# EasyEDA Pro project ProProject_51_card_2024-05-25.epro

# Schematic ProjectM.2-核心板
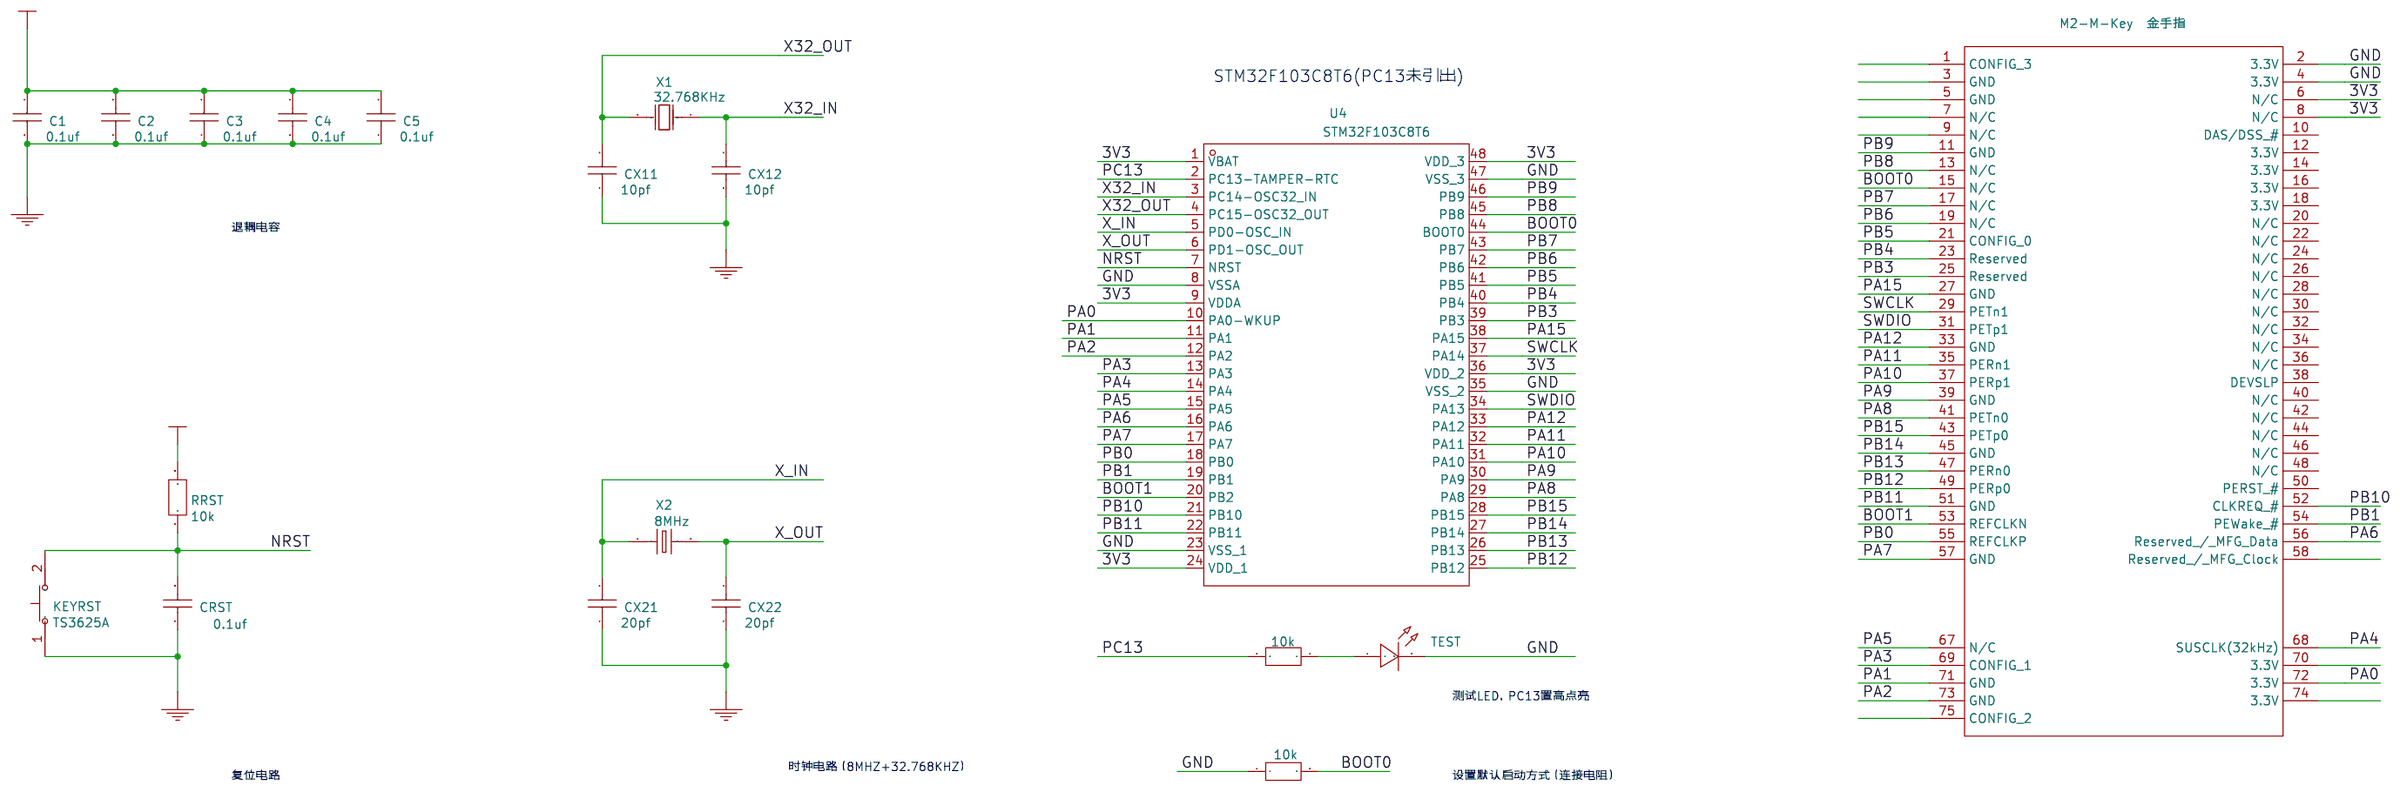
[diagram p0: schematic sheet]

## Parts
C1  0.1uf
C2  0.1uf
C3  0.1uf
C4  0.1uf
C5  0.1uf
CRST  0.1uf
CX11  10pf
CX12  10pf
CX21  20pf
CX22  20pf
KEYRST  TS3625A
RBM1  10k
RLED  10k
RRST  10k
TEST  TEST
U1  M2-M-Key  金手指
U4  STM32F103C8T6
X1  32.768KHz
X2  8MHz

## Library data of the parts
C1-C5 CRST CX11 CX12 CX21 CX22 = ?: Capacitor
KEYRST = TS3625A: Supplier: LCSC; Supplier Part: C398053; Manufacturer: SHOU HAN
RBM1 RLED RRST = 10k
TEST = 19-217/R6C-AL1M2VY/3T: Manufacturer: EVERLIGHT(台湾亿光); Supplier Part: C72044; Supplier: LCSC
U1 = M2-M-Key  金手指
U4 = STM32F103C8T6: Supplier: LCSC; Manufacturer: STMicroelectronics; image: //image.lceda.cn/szlcsc/C8734.jpg; Supplier Part: C8734; JLCPCB Part Class: Basic
X1 = VT-200-F-32.768kHz-20PPM-12.5pF: Supplier: LCSC; Supplier Part: C398714; Manufacturer: Seiko
X2 = XIHCELNANF-8MHZ: Supplier: LCSC; Supplier Part: C295088; Manufacturer: TAITIEN Elec

## Nets
3V3: C1.2 C2.2 C3.2 C4.2 C5.2 RRST.2 U1.6(N/C) U1.8(N/C) U4.1(VBAT) U4.9(VDDA) U4.24(VDD_1) U4.36(VDD_2) U4.48(VDD_3)
GND: C1.1 C2.1 C3.1 C4.1 C5.1 CRST.1 CX11.1 CX12.1 CX21.1 CX22.1 KEYRST.1 RBM1.1 TEST.2 U1.2(3.3V) U1.4(3.3V) U4.8(VSSA) U4.23(VSS_1) U4.35(VSS_2) U4.47(VSS_3)
BOOT0: RBM1.2 U1.15(N/C) U4.44(BOOT0)
BOOT1: U1.53(REFCLKN) U4.20(PB2)
NRST: CRST.2 KEYRST.2 RRST.1 U4.7(NRST)
PA0: U1.72(3.3V) U4.10(PA0-WKUP)
PA1: U1.71(GND) U4.11(PA1)
PA2: U1.73(GND) U4.12(PA2)
PA3: U1.69(CONFIG_1) U4.13(PA3)
PA4: U1.68(SUSCLK(32kHz)) U4.14(PA4)
PA5: U1.67(N/C) U4.15(PA5)
PA6: U1.56(Reserved / MFG Data) U4.16(PA6)
PA7: U1.57(GND) U4.17(PA7)
PA8: U1.41(PETn0) U4.29(PA8)
PA9: U1.39(GND) U4.30(PA9)
PA10: U1.37(PERp1) U4.31(PA10)
PA11: U1.35(PERn1) U4.32(PA11)
PA12: U1.33(GND) U4.33(PA12)
PA15: U1.27(GND) U4.38(PA15)
PB0: U1.55(REFCLKP) U4.18(PB0)
PB1: U1.54(PEWake #) U4.19(PB1)
PB3: U1.25(Reserved) U4.39(PB3)
PB4: U1.23(Reserved) U4.40(PB4)
PB5: U1.21(CONFIG_0) U4.41(PB5)
PB6: U1.19(N/C) U4.42(PB6)
PB7: U1.17(N/C) U4.43(PB7)
PB8: U1.13(N/C) U4.45(PB8)
PB9: U1.11(GND) U4.46(PB9)
PB10: U1.52(CLKREQ #) U4.21(PB10)
PB11: U1.51(GND) U4.22(PB11)
PB12: U1.49(PERp0) U4.25(PB12)
PB13: U1.47(PERn0) U4.26(PB13)
PB14: U1.45(GND) U4.27(PB14)
PB15: U1.43(PETp0) U4.28(PB15)
PC13: RLED.2 U4.2(PC13-TAMPER-RTC)
SWCLK: U1.29(PETn1) U4.37(PA14)
SWDIO: U1.31(PETp1) U4.34(PA13)
X32_IN: CX12.2 U4.3(PC14-OSC32_IN) X1.1(OSC1)
X32_OUT: CX11.2 U4.4(PC15-OSC32_OUT) X1.2(OSC2)
X_IN: CX21.2 U4.5(PD0-OSC_IN) X2.1
X_OUT: CX22.2 U4.6(PD1-OSC_OUT) X2.2
Net-(RLED-1): RLED.1 TEST.1

Not connected (* = marked no-connect by the designer): U1 1(CONFIG_3) 3(GND) 5(GND) 7(N/C) 9(N/C) 10(DAS/DSS #) 12(3.3V) 14(3.3V) 16(3.3V) 18(3.3V) 20(N/C) 22(N/C) 24(N/C) 26(N/C) 28(N/C) 30(N/C) 32(N/C) 34(N/C) 36(N/C) 38(DEVSLP) 40(N/C) 42(N/C) 44(N/C) 46(N/C) 48(N/C) 50(PERST #) 58(Reserved / MFG Clock) 70(3.3V) 74(3.3V) 75(CONFIG_2)

## Notes on the sheet
- STM32F103C8T6(PC13未引出)
- 退耦电容
- 测试LED，PC13置高点亮
- 时钟电路（8MHZ+32.768KHZ）
- 复位电路
- 设置默认启动方式（连接电阻）

# Schematic Schematic1
Create Date: 2024-05-22; Page Name: P1; Project Name: 51_card; Schematic Name: Schematic1; Update Date: 2024-05-22; Company: 嘉立创EDA; Page Size: A4; Version: V1.0
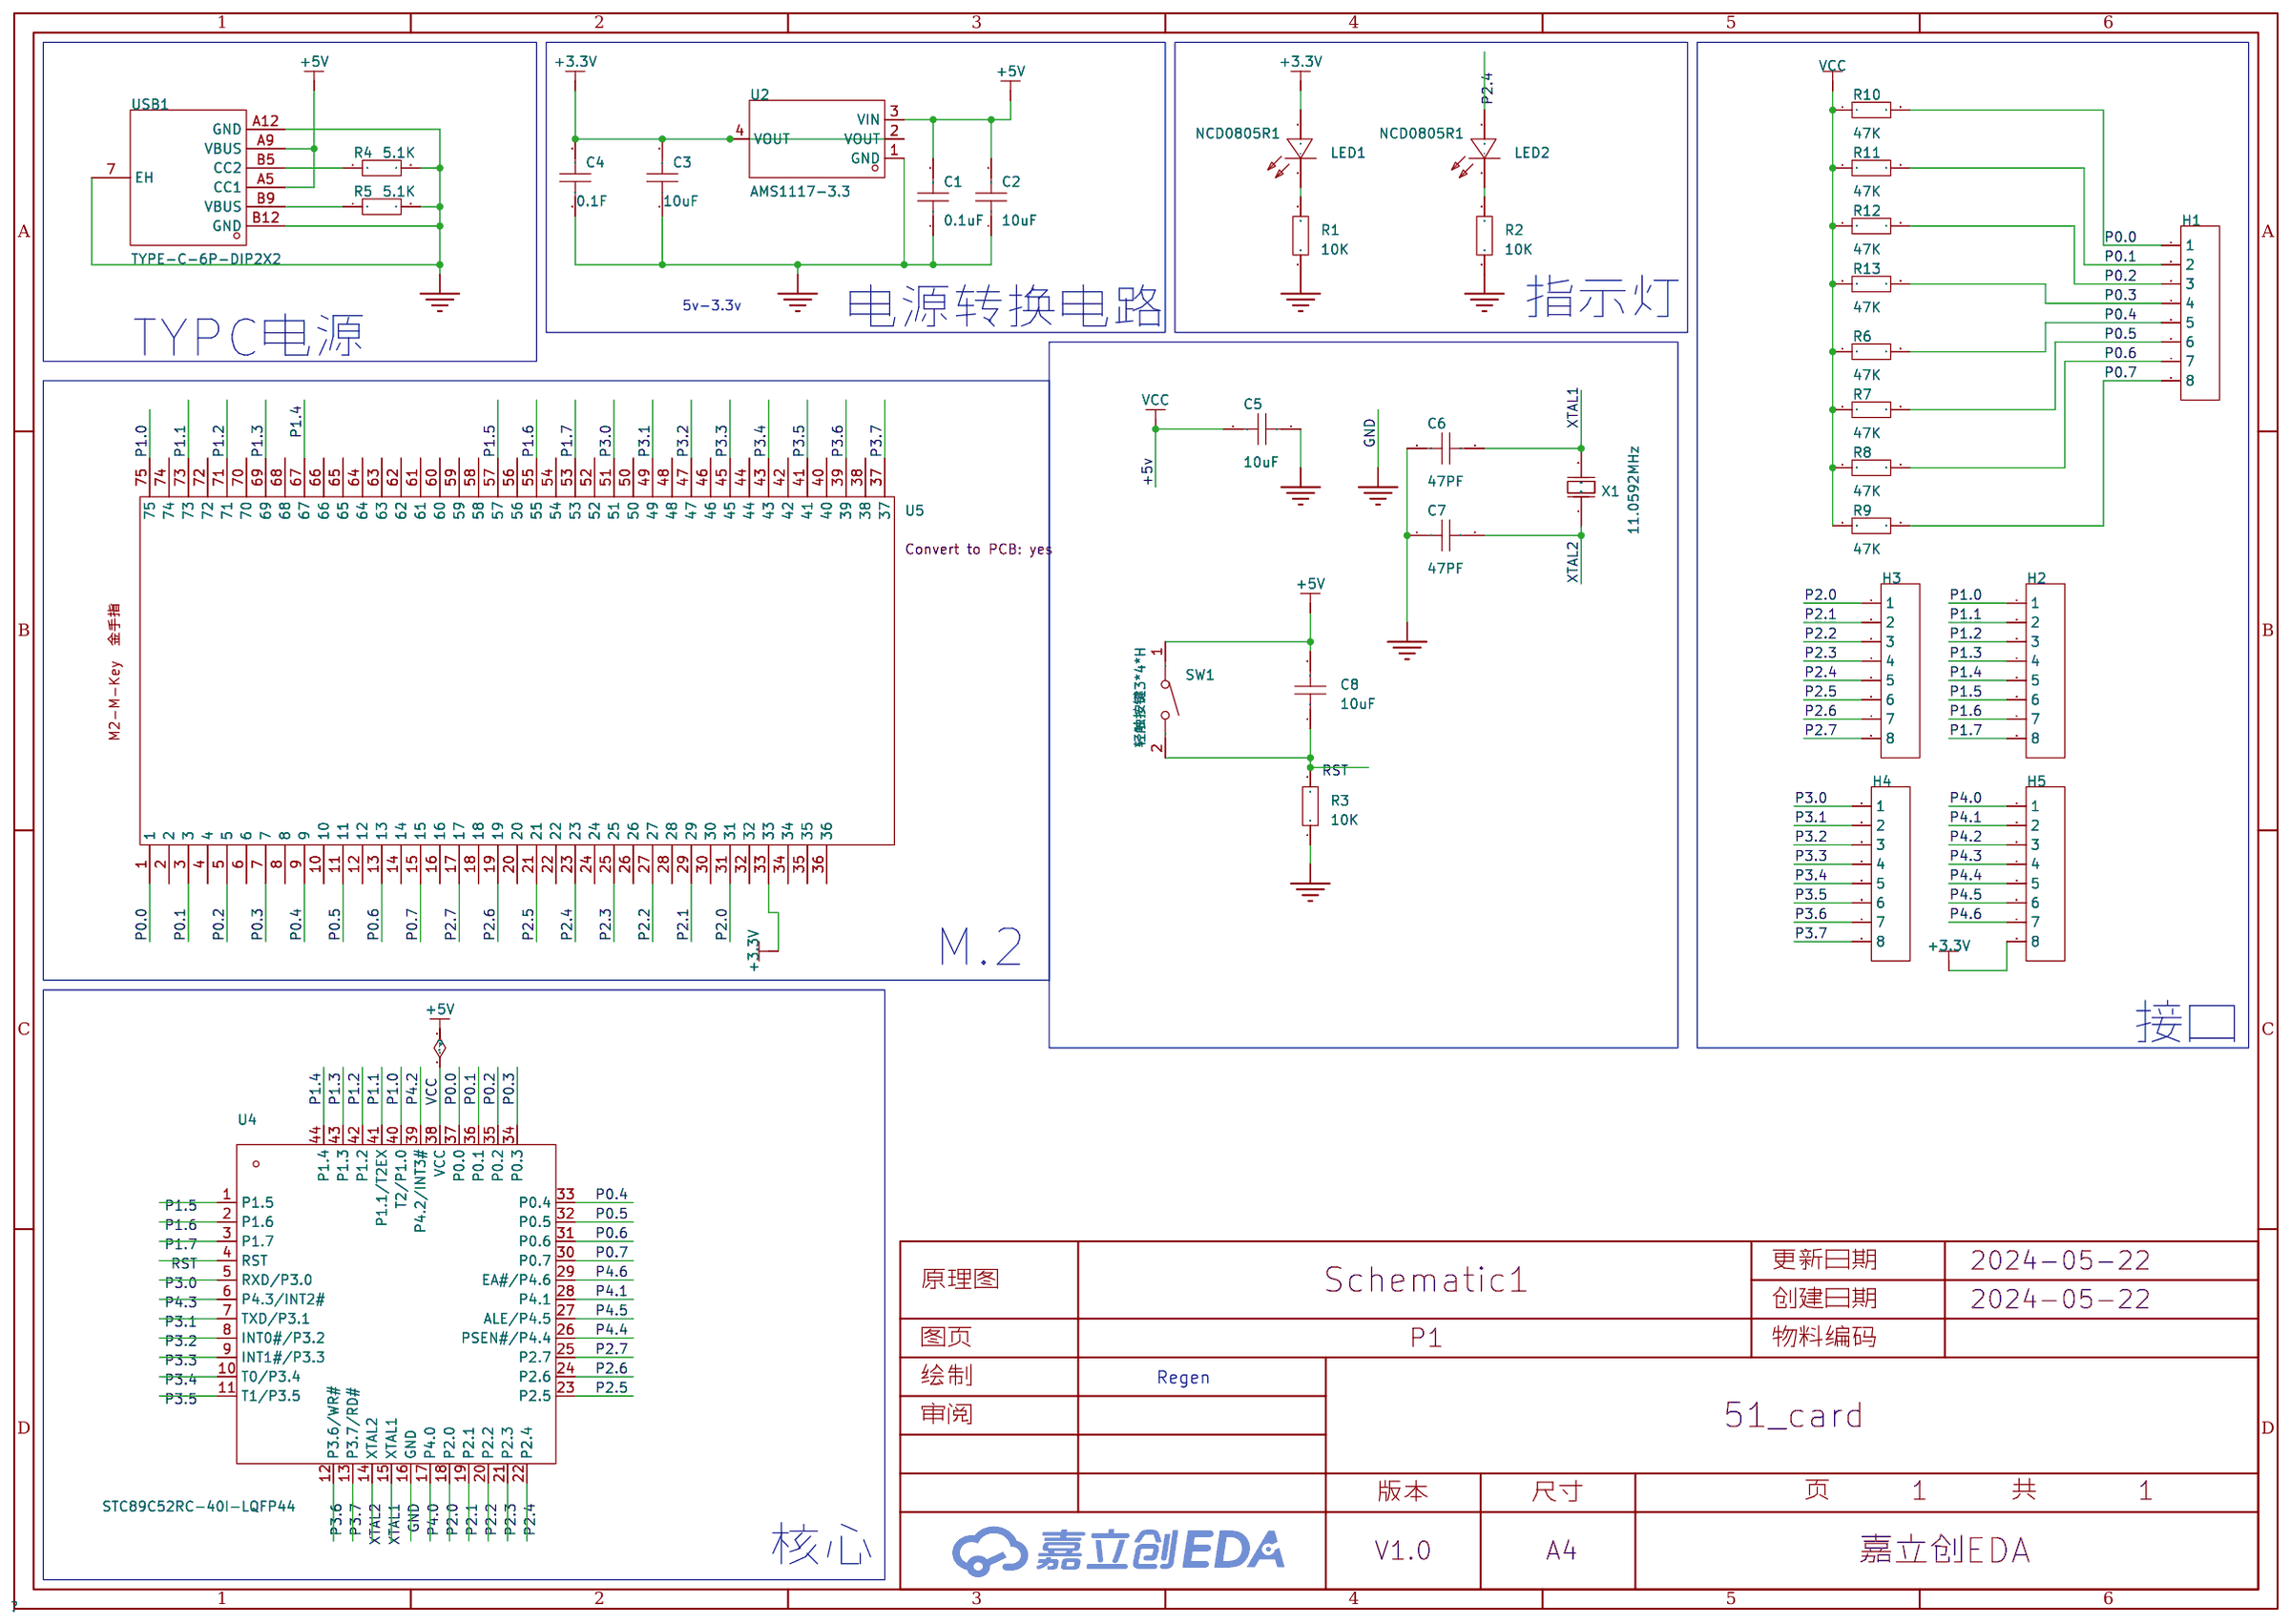
[diagram p1: schematic sheet]

## Parts
C1  0.1uF  [C0603]
C2  10uF  [C0603]
C3  10uF  [C0603]
C4  0.1F  [C0603]
C5  10uF  [C0603]
C6  47PF  [C0603]
C7  47PF  [C0603]
C8  10uF  [C0805]
H1  -  [HDR-TH_8P-P2.54-V-F-1]
H2  -  [HDR-TH_8P-P2.54-V-F-1]
H3  -  [HDR-TH_8P-P2.54-V-F-1]
H4  -  [HDR-TH_8P-P2.54-V-F-1]
H5  -  [HDR-TH_8P-P2.54-V-F-1]
LED1  NCD0805R1  [LED0805-R-RD]
LED2  NCD0805R1  [LED0805-R-RD]
R1  10K  [R0603]
R2  10K  [R0603]
R3  10K  [R0805]
R4  5.1K  [R0805]
R5  5.1K  [R0805]
R6  47K  [R0805]
R7  47K  [R0805]
R8  47K  [R0805]
R9  47K  [R0805]
R10  47K  [R0805]
R11  47K  [R0805]
R12  47K  [R0805]
R13  47K  [R0805]
SW1  轻触按键3*4*H  [SW-SMD_L4.0-W2.9-LS5.0]
U2  AMS1117-3.3  [SOT-223-3_L6.5-W3.4-P2.30-LS7.0-BR]
U4  STC89C52RC-40I-LQFP44  [LQFP-44_L10.0-W10.0-P0.80-LS12.0-BL]
U5  -  [m.2]
USB1  TYPE-C-6P-DIP2X2  [TYPE-C-SMD_TYPE-C-6P]
X1  11.0592MHz  [HC-49S_L11.4-W4.8]

## Library data of the parts
C1-C7 = CAP_0603: Supplier Footprint: 0603
C8 = CAP_0805: Supplier Footprint: 0805
H1-H5 = HDR-F_2.54_1x8P: Supplier Part: C27438; Supplier Footprint: 插件
LED1 LED2 = NCD0805R1: 灯头类型:-;发光颜色:红色;正向电压(VF):1.6V~2.6V;功率:65mW;正向电流:20mA;主波长:615nm~630nm;二极管配置:独立二极管;透镜颜色:无色透明透镜;色温:-;发光强度:67mcd~195mcd;发光角度:130°;载带方式:-;工作温度:-30℃~+85℃;; Supplier Part: C84256; Manufacturer: 国星光电; Supplier Footprint: 0805; JLCPCB Part Class: 基础库; Datasheet: https://atta.szlcsc.com/upload/public/pdf/source/20200820/C84256_F0A75A43B3EAD75808600A0514C76B99.pdf; Supplier: LCSC; Emitted Color: 红色; Forward Voltage (VF): 1.6V~2.6V; Power Dissipation: 65mW; Forward Current: 20mA; Dominant Wavelength: 615nm~630nm; Diode Configuration: 独立二极管; Lens Color: 无色透明透镜; Luminous Intensity: 67mcd~195mcd; Viewing Angle: 130°; Operating Temperature: -30℃~+85℃
R1 R2 = Res_0603: Supplier Footprint: 0603
R3-R13 = Res_0805: Supplier Footprint: 0805
SW1 = 轻触按键3*4*H: Supplier Part: C9900017573; Supplier Footprint: 轻触按键3*4*2.5; JLCPCB Part Class: 扩展库; Supplier: LCSC
U2 = AMS1117-3.3_C6186: 输出类型:固定;最大输入电压:-;输出电压:3.3V;最大输出电流:1A;电源纹波抑制比(PSRR):72dB@(120Hz);输出极性:正极;; LCSC Part Name: 输出3.3V 1A; Supplier Part: C6186; Manufacturer: AMS; Supplier Footprint: SOT-223-3; JLCPCB Part Class: 基础库; Datasheet: https://atta.szlcsc.com/upload/public/pdf/source/20180727/C6186_7A095716F0823C02F1997A905E26C086.pdf; Supplier: LCSC; Output Type: 固定; Output Voltage: 3.3V; MAX Output Current: 1A; Power Supply Rejection Ratio (PSRR): 72dB@(120Hz); Dropout Voltage: 1.3V@(800mA); Output Polarity: 正极; Number of Outputs: 1
U4 = STC89C52RC-40I-LQFP44: CPU内核:51系列;程序存储容量:8KB;RAM总容量:512Byte;GPIO端口数量:39;工作电压范围:3.3V~5.5V;CPU最大主频:-;程序存储器类型:FLASH;; Supplier Part: C8707; Manufacturer: STC(宏晶); Supplier Footprint: LQFP-44(10x10); JLCPCB Part Class: 扩展库; Datasheet: https://atta.szlcsc.com/upload/public/pdf/source/20131218/1457706663573.pdf; Supplier: LCSC; CPU Core: 51系列; Program Storage Size: 8KB; RAM Size: 512Byte; GPIO Ports Number: 39; Operating Voltage Range: 3.3V~5.5V; Program Memory Type: FLASH; Operating Temperature Range: -40℃~+85℃; 16Bit Timer: 3; UART/USART: 1; Peripheral/Function: 看门狗; Watchdog: 有
U5 = m.2 gloden finger
USB1 = TYPE-C-6P-DIP2X2: Supplier Part: C9900017627; Supplier Footprint: TYPE-C-6P; JLCPCB Part Class: 扩展库; Supplier: LCSC
X1 = 49MD-11.0592-20-20-20/A: 晶振类型:贴片晶振;频率:11.0592MHz;常温频差:±20ppm;外接负载电容:20pF;频率稳定度(全温):±20ppm;; LCSC Part Name: 11.0592MHz ±20ppm 20pF; Supplier Part: C240958; Manufacturer: LIMING(利明); Supplier Footprint: HC-49S-SMD; JLCPCB Part Class: 扩展库; Datasheet: https://atta.szlcsc.com/upload/public/pdf/source/20180904/C240991_E2F04D311D9C4C22D828B1AE19EA4706.pdf; Supplier: LCSC; Crystal Type: 贴片晶振; Normal temperature Frequency Tolerance: ±20ppm; External load capacitor: 20pF; Frequency Stability(Full temperature range): ±20ppm; Operating Temperature: -20℃~+70℃

## Nets
+3.3V: C3.2 C4.2 H5.8 LED1.1(+) U2.2(VOUT) U2.4(VOUT) U5.33
+5V: C1.2 C2.2 C5.2 C8.2 R6.1 R7.1 R8.1 R9.1 R10.1 R11.1 R12.1 R13.1 SW1.1 U2.3(VIN) U4.38(VCC) USB1.A5(CC1) USB1.A9(VBUS)
GND: C1.1 C2.1 C3.1 C4.1 C5.1 C6.1 C7.1 R1.1 R2.1 R3.1 R4.2 R5.2 U2.1(GND) U4.16(GND) USB1.7(EH) USB1.A12(GND) USB1.B12(GND)
P0.0: H1.1 R10.2 U4.37(P0.0) U5.1
P0.1: H1.2 R11.2 U4.36(P0.1) U5.3
P0.2: H1.3 R12.2 U4.35(P0.2) U5.5
P0.3: H1.4 R13.2 U4.34(P0.3) U5.7
P0.4: H1.5 R6.2 U4.33(P0.4) U5.9
P0.5: H1.6 R7.2 U4.32(P0.5) U5.11
P0.6: H1.7 R8.2 U4.31(P0.6) U5.13
P0.7: H1.8 R9.2 U4.30(P0.7) U5.15
P1.0: H2.1 U4.40(T2/P1.0) U5.75
P1.1: H2.2 U4.41(P1.1/T2EX) U5.73
P1.2: H2.3 U4.42(P1.2) U5.71
P1.3: H2.4 U4.43(P1.3) U5.69
P1.4: H2.5 U4.44(P1.4) U5.67
P1.5: H2.6 U4.1(P1.5) U5.57
P1.6: H2.7 U4.2(P1.6) U5.55
P1.7: H2.8 U4.3(P1.7) U5.53
P2.0: H3.1 U4.18(P2.0) U5.31
P2.1: H3.2 U4.19(P2.1) U5.29
P2.2: H3.3 U4.20(P2.2) U5.27
P2.3: H3.4 U4.21(P2.3) U5.25
P2.4: H3.5 LED2.1(+) U4.22(P2.4) U5.23
P2.5: H3.6 U4.23(P2.5) U5.21
P2.6: H3.7 U4.24(P2.6) U5.19
P2.7: H3.8 U4.25(P2.7) U5.17
P3.0: H4.1 U4.5(RXD/P3.0) U5.51
P3.1: H4.2 U4.7(TXD/P3.1) U5.49
P3.2: H4.3 U4.8(INT0#/P3.2) U5.47
P3.3: H4.4 U4.9(INT1#/P3.3) U5.45
P3.4: H4.5 U4.10(T0/P3.4) U5.43
P3.5: H4.6 U4.11(T1/P3.5) U5.41
P3.6: H4.7 U4.12(P3.6/WR#) U5.39
P3.7: H4.8 U4.13(P3.7/RD#) U5.37
P4.0: H5.1 U4.17(P4.0)
P4.1: H5.2 U4.28(P4.1)
P4.2: H5.3 U4.39(P4.2/INT3#)
P4.3: H5.4 U4.6(P4.3/INT2#)
P4.4: H5.5 U4.26(PSEN#/P4.4)
P4.5: H5.6 U4.27(ALE/P4.5)
P4.6: H5.7 U4.29(EA#/P4.6)
RST: C8.1 R3.2 SW1.2 U4.4(RST)
XTAL1: C6.2 U4.15(XTAL1) X1.2(OSC2)
XTAL2: C7.2 U4.14(XTAL2) X1.1(OSC1)
$1N502: LED1.2(-) R1.2
$1N504: LED2.2(-) R2.2
$1N2677: R4.1 USB1.B5(CC2)
$1N2681: R5.1 USB1.B9(VBUS)

Not connected (* = marked no-connect by the designer): U5 2 4 6 8 10 12 14 16 18 20 22 24 26 28 30 32 34 35 36 38 40 42 44 46 48 50 52 54 56 58 59 60 61 62 63 64 65 66 68 70 72 74

## Notes on the sheet
- 5v-3.3v
- 电源转换电路
- 指示灯
- TYPC电源
- M.2
- 接口
- Regen
- 核心

# Board PCB1
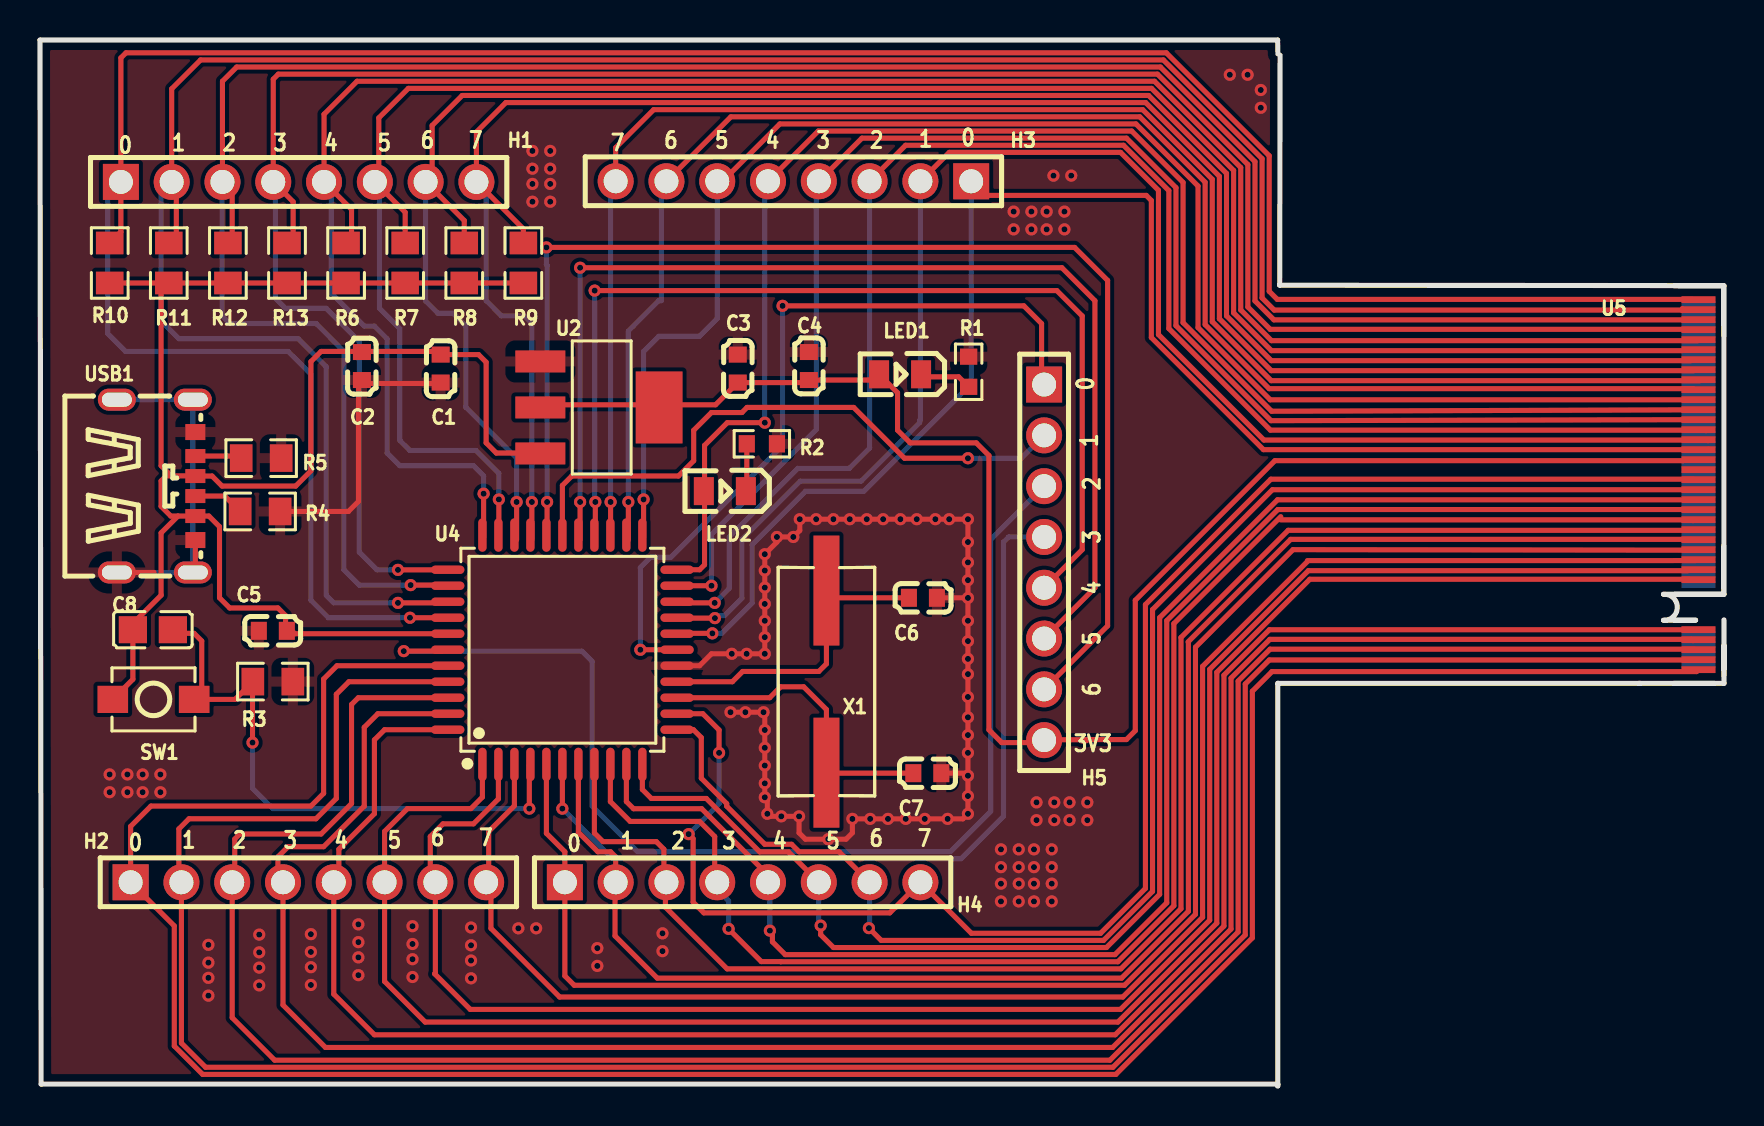
[diagram p2: board, top side]
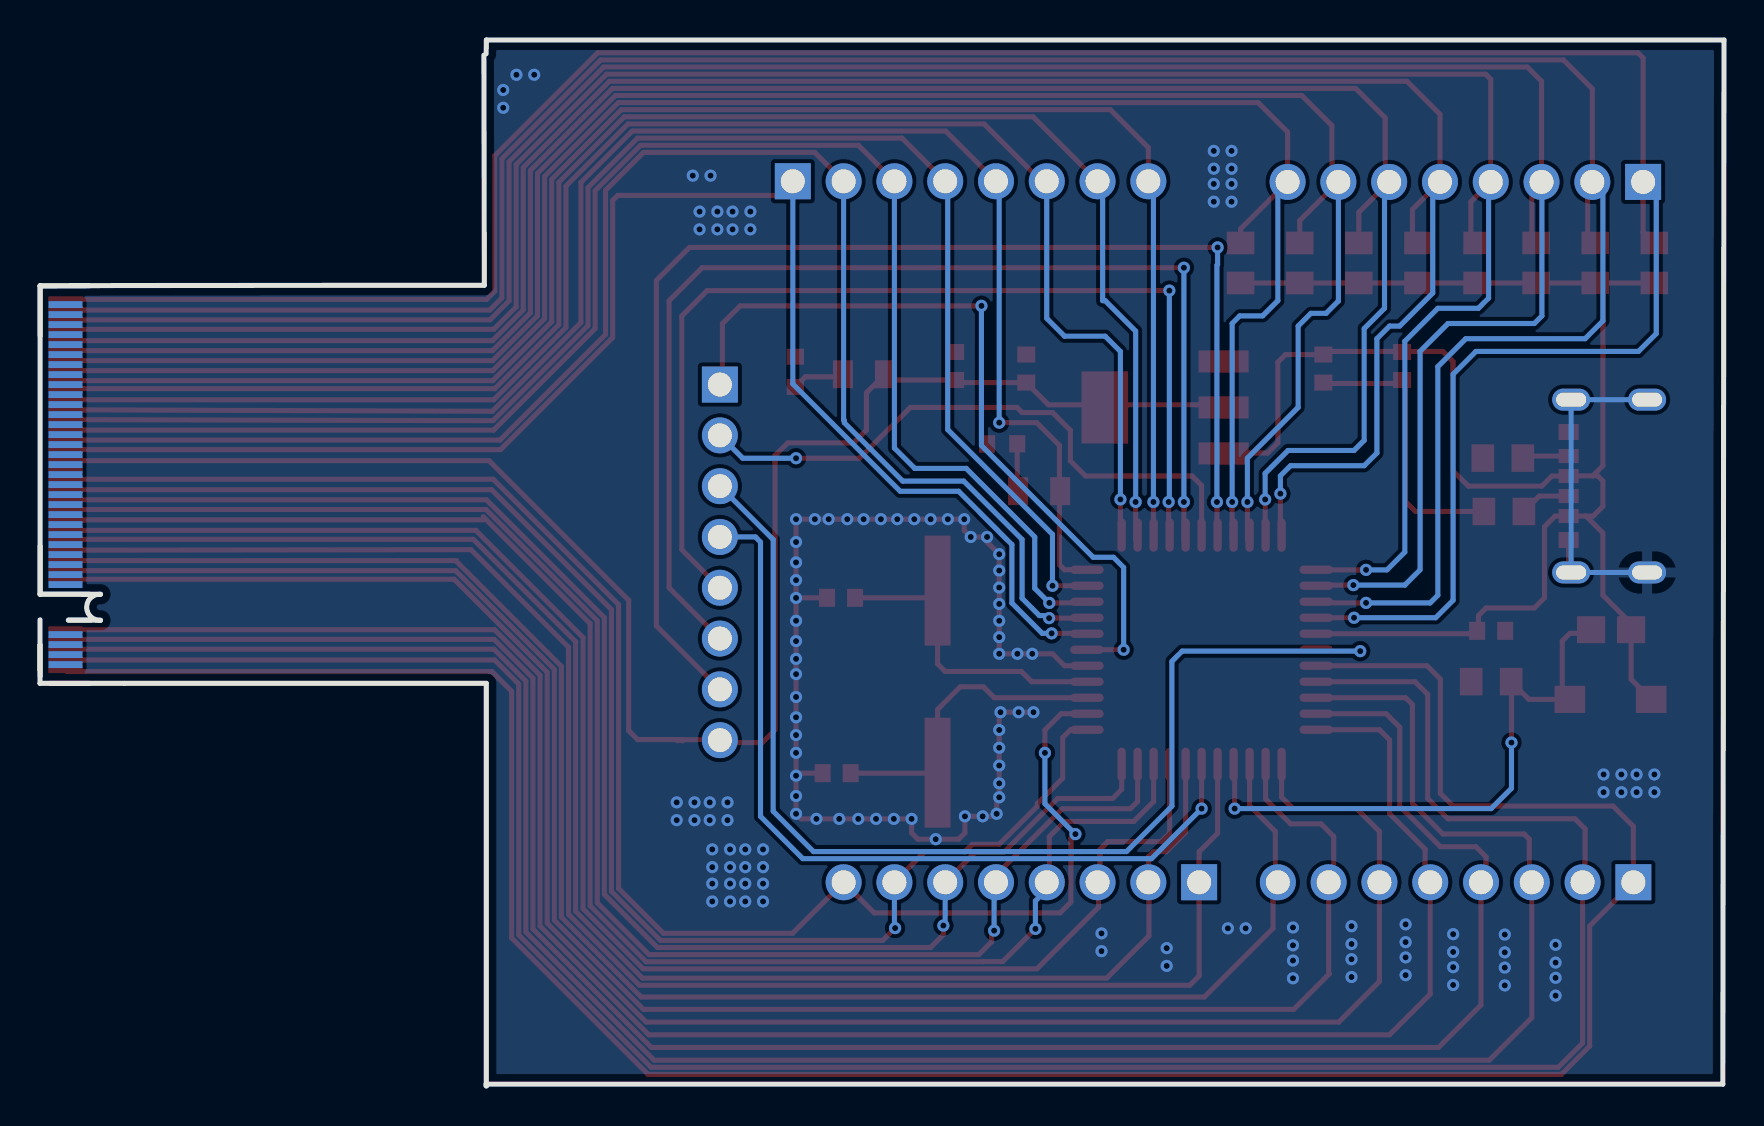
[diagram p3: board, bottom side, seen from below]

Outline 84.22 x 52.3 mm; copper layers: Top Layer, Bottom Layer. Coordinates in mm from the lower left corner of the outline.
Outline path: 61.89,0 61.9,0.01 61.9,20.13 80,20.13 ; 61.91,51.61 61.9,52.3 0,52.3 0.06,0.09 61.91,0.09 61.91,0.02 ; 79.99,40.03 62,40.04 62.02,51.54
Stack: Top Layer 0.035mm / Dielectric1 1.51mm FR4 er 4.5 / Bottom Layer 0.035mm

## Design rules (mm)
net XTAL2: DP1
net XTAL1: DP1
template: JLCPCB Capability(Two Layers Board)
spacing copperThickness1oz (default): track to track 0.102, other pairs 0.152 to 0.3
spacing copperThickness2oz: track to track 0.203, other pairs 0.152 to 0.3
track width copperThickness1oz (default): min 0.127, default 0.254, max 2.54
track width copperThickness2oz: min 0.203, default 0.254, max 2.54
differential pair differentialPair (default): width min 0.127, default 0.254, max 2.54; gap min 0.152, default 0.152
via viaSize (default): diameter min 0.5, default 0.61, max 10; hole min 0.3, default 0.305, max 6.3

## Placement (name value [footprint] x y rotation side)
C1  0.1uF  [C0603]  20.04 35.87 90 top
C2  10uF  [C0603]  16.1 36 90 top
C3  10uF  [C0603]  34.9 35.87 270 top
C4  0.1F  [C0603]  38.45 36 270 top
C5  10uF  [C0603]  11.64 22.76 0 top
C6  47PF  [C0603]  44.16 24.41 180 top
C7  47PF  [C0603]  44.38 15.64 180 top
C8  10uF  [C0805]  5.65 22.82 180 top
H1  -  [HDR-TH_8P-P2.54-V-F-1]  12.94 45.21 0 top
H2  -  [HDR-TH_8P-P2.54-V-F-1]  13.42 10.19 0 top
H3  -  [HDR-TH_8P-P2.54-V-F-1]  37.68 45.24 180 top
H4  -  [HDR-TH_8P-P2.54-V-F-1]  35.14 10.19 0 top
H5  -  [HDR-TH_8P-P2.54-V-F-1]  50.22 26.18 270 top
LED1  NCD0805R1  [LED0805-R-RD]  43.01 35.59 180 top
LED2  NCD0805R1  [LED0805-R-RD]  34.25 29.75 180 top
R1  10K  [R0603]  46.44 35.71 270 top
R2  10K  [R0603]  36.1 32.11 180 top
R3  10K  [R0805]  11.64 20.22 180 top
R4  5.1K  [R0805]  11.01 28.73 0 top
R5  5.1K  [R0805]  11.06 31.4 0 top
R6  47K  [R0805]  15.31 41.15 90 top
R7  47K  [R0805]  18.26 41.15 90 top
R8  47K  [R0805]  21.22 41.15 90 top
R9  47K  [R0805]  24.17 41.15 90 top
R10  47K  [R0805]  3.49 41.15 90 top
R11  47K  [R0805]  6.44 41.15 90 top
R12  47K  [R0805]  9.4 41.15 90 top
R13  47K  [R0805]  12.35 41.15 90 top
SW1  轻触按键3*4*H  [SW-SMD_L4.0-W2.9-LS5.0]  5.68 19.33 0 top
U2  AMS1117-3.3  [SOT-223-3_L6.5-W3.4-P2.30-LS7.0-BR]  27.99 33.93 180 top
U4  STC89C52RC-40I-LQFP44  [LQFP-44_L10.0-W10.0-P0.80-LS12.0-BL]  26.13 21.81 0 top
U5  -  [m.2]  82.1 29.74 0 top
USB1  TYPE-C-6P-DIP2X2  [TYPE-C-SMD_TYPE-C-6P]  5.81 30 270 top
X1  11.0592MHz  [HC-49S_L11.4-W4.8]  39.33 20.22 90 top

## Footprints (pads in the part's own frame, mm; a bottom-side part is the same pattern mirrored in y, then rotated)
C0603
  rect 0.8x0.9 smd: 1(-0.7,0) 2(0.7,0)
C0805
  rect 1.41x1.35 smd: 1(-1,0) 2(1,0)
HC-49S_L11.4-W4.8
  rect 5.5x1.3 smd: 1(-4.553,0) 2(4.553,0)
HDR-TH_8P-P2.54-V-F-1
  rect 1.8x1.8 hole 1.2: 1(-8.89,0)
  round 1.8 hole 1.2: 2(-6.35,0) 3(-3.81,0) 4(-1.27,0) 5(1.27,0) 6(3.81,0) 7(6.35,0) 8(8.89,0)
LED0805-R-RD
  rect 1x1.399 smd: 1(1.05,0) 2(-1.05,0)
LQFP-44_L10.0-W10.0-P0.80-LS12.0-BL
  oval 0.42x1.67 smd: 1(-4,-5.735) 2(-3.2,-5.735) 3(-2.4,-5.735) 4(-1.6,-5.735) 5(-0.8,-5.735) 6(0,-5.735) 7(0.8,-5.735) 8(1.6,-5.735) 9(2.4,-5.735) 10(3.2,-5.735) 11(4,-5.735) 23(4,5.735) 24(3.2,5.735) 25(2.4,5.735) 26(1.6,5.735) 27(0.8,5.735) 28(0,5.735) 29(-0.8,5.735) 30(-1.6,5.735) 31(-2.4,5.735) 32(-3.2,5.735) 33(-4,5.735)
  oval 1.67x0.42 smd: 12(5.735,-4) 13(5.735,-3.2) 14(5.735,-2.4) 15(5.735,-1.6) 16(5.735,-0.8) 17(5.735,0) 18(5.735,0.8) 19(5.735,1.6) 20(5.735,2.4) 21(5.735,3.2) 22(5.735,4) 34(-5.735,4) 35(-5.735,3.2) 36(-5.735,2.4) 37(-5.735,1.6) 38(-5.735,0.8) 39(-5.735,0) 40(-5.735,-0.8) 41(-5.735,-1.6) 42(-5.735,-2.4) 43(-5.735,-3.2) 44(-5.735,-4)
m.2
  rect 1.7x0.34 smd: 1(0.849,9.58) 3(0.849,9.079) 5(0.849,8.579) 7(0.849,8.079) 9(0.849,7.58) 11(0.849,7.08) 13(0.849,6.58) 15(0.849,6.08) 17(0.849,5.58) 19(0.849,5.08) 21(0.849,4.58) 23(0.849,4.08) 25(0.849,3.579) 27(0.849,3.079) 29(0.849,2.579) 31(0.849,2.079) 33(0.849,1.579) 35(0.849,1.079) 37(0.849,0.58) 39(0.849,0.08) 41(0.849,-0.42) 43(0.849,-0.92) 45(0.849,-1.421) 47(0.849,-1.921) 49(0.849,-2.421) 51(0.849,-2.921) 53(0.849,-3.421) 55(0.849,-3.921) 57(0.849,-4.42) 67(0.849,-6.92) 69(0.849,-7.42) 71(0.849,-7.92) 73(0.849,-8.421) 75(0.849,-8.921)
  rect 1.7x0.34 smd far side: 2(0.849,9.33) 4(0.849,8.831) 6(0.849,8.331) 8(0.849,7.831) 10(0.849,7.331) 12(0.849,6.831) 14(0.849,6.331) 16(0.849,5.831) 18(0.849,5.331) 20(0.848,4.829) 22(0.849,4.331) 24(0.849,3.831) 26(0.849,3.331) 28(0.849,2.831) 30(0.849,2.331) 32(0.849,1.831) 34(0.849,1.331) 36(0.849,0.831) 38(0.849,0.331) 40(0.849,-0.169) 42(0.848,-0.667) 44(0.849,-1.169) 46(0.849,-1.669) 48(0.849,-2.169) 50(0.849,-2.669) 52(0.849,-3.169) 54(0.849,-3.669) 56(0.849,-4.169) 58(0.849,-4.669) 68(0.849,-7.169) 70(0.849,-7.669) 72(0.849,-8.169) 74(0.849,-8.669)
R0603
  rect 0.806x0.864 smd: 1(-0.753,0) 2(0.753,0)
R0805
  rect 1.133x1.377 smd: 1(-1,0) 2(1,0)
SOT-223-3_L6.5-W3.4-P2.30-LS7.0-BR
  rect 2.5x1.1 smd: 1(2.97,-2.3) 2(2.97,0) 3(2.97,2.3)
  rect 2.34x3.6 smd: 4(-2.97,0)
SW-SMD_L4.0-W2.9-LS5.0
  rect 1.53x1.36 smd: 1(-2.035,0) 2(2.035,0)
TYPE-C-SMD_TYPE-C-6P
  oval 1.1x1.9 hole 0.7x1.5: 7(-4.32,1.837) 7(-4.32,-1.962) 7(4.32,1.837) 7(4.32,-1.962)
  rect 0.7x1 smd: A5(-0.5,1.962) A9(1.5,1.962) B5(0.5,1.962) B9(-1.5,1.962)
  rect 0.8x1 smd: A12(2.7,1.962) B12(-2.7,1.962)

## Nets
As in the schematic.

Pads without a net: U5 2 4 6 8 10 12 14 16 18 20 22 24 26 28 30 32 34 35 36 38 40 42 44 46 48 50 52 54 56 58 68 70 72 74

## Via types
v1: diameter 0.61, hole 0.305, Top Layer to Bottom Layer, 174 vias

## Routing (per net, layer and track width the routed paths; a pad name or vN(x,y) marks a point on that pad's centre or on a via; arc(x,y) is an arc through that point)
+3.3V: length 84.4
  Top Layer w0.254: 52.34,17.26 52.29,17.32 52.15,17.32 ; 52.15,17.32 52.09,17.25 ; 52.15,17.32 52.16,17.32 54.33,17.32 54.78,17.77 54.78,24.29 61.76,31.27 82.18,31.27 82.24,31.32 ; 52.15,17.32 50.23,17.32 ; 25.18,34.06 33.79,34.06 C3.2 38.33,35.17 C4.2 41.68,35.3 LED1.1 42.89,34.66 42.89,32.79 43.52,32.16 46.82,32.16 47.46,31.52 47.46,17.81 48.09,17.17 50.13,17.17 50.25,17.05
+5V: length 92
  Top Layer w0.254: SW1.1 4.65,20.34 C8.2 4.65,23.13 6.06,24.54 6.06,27.66 6.9,28.5 ; 6.9,28.5 USB1.A9 8.45,28.5 8.98,27.97 8.98,24.41 9.49,23.9 11.9,23.9 12.28,23.52 12.28,22.83 C5.2 ; 6.9,28.5 6.54,28.5 6.06,28.98 6.06,30.25 6.31,30.51 6.56,30.51 ; R11.1 6.06,39.77 6.06,31.02 6.56,30.51 ; R11.1 R12.1 R13.1 R6.1 R7.1 R8.1 R9.1 ; R11.1 R10.1 ; 20.39,22.61 12.74,22.61 12.34,23.01 ; 16.07,36.73 14.06,36.73 13.55,36.22 13.55,30.76 12.79,30 9.1,30 8.6,30.5 USB1.A5 7.76,30.51 6.56,30.51 ; 16.07,36.73 C2.2 ; 16.07,36.73 19.88,36.73 C1.2 21.93,36.57 22.31,36.19 22.31,32.16 22.82,31.65 25.07,31.65 25.18,31.76
GND: length 91.6
  Top Layer w0.254: v1(46.41,24.41) v1(46.41,23.26) v1(46.41,22.25) v1(46.41,21.36) v1(46.41,20.6) v1(46.41,19.45) v1(46.41,18.44) v1(46.41,17.55) v1(46.41,16.66) v1(46.41,15.52) ; v1(46.41,24.41) 46.4,24.41 C6.1 ; v1(46.41,24.41) v1(46.41,25.29) v1(46.41,26.18) v1(46.41,27.2) v1(46.41,28.34) v1(45.47,28.34) v1(44.78,28.34) v1(43.85,28.34) v1(43.03,28.34) v1(42.17,28.34) v1(41.35,28.34) v1(40.5,28.34) v1(39.68,28.34) v1(38.82,28.34) v1(38,28.34) 38,27.78 v1(37.67,27.45) v1(36.86,27.45) 36.86,27.2 v1(36.25,26.59) v1(36.25,25.77) v1(36.25,24.92) v1(36.25,24.11) v1(36.25,23.26) v1(36.25,22.44) v1(36.25,21.61) v1(35.34,21.61) v1(34.6,21.61) 33.58,21.61 32.98,21.01 U4.16 ; 7.77,27.3 7.77,25.8 7.65,25.68 ; 15.93,35.13 15.93,29.23 15.43,28.73 R4.2 ; 15.93,35.13 C2.1 ; 15.93,35.13 19.99,35.13 C1.1 ; v1(34.53,18.69) v1(35.28,18.69) v1(36.18,18.69) 36.25,18.63 v1(36.25,17.8) v1(36.25,16.91) v1(36.25,16.02) v1(36.25,15.13) v1(36.25,14.44) 36.38,14.31 v1(36.38,13.61) 36.5,13.48 v1(37.07,13.48) v1(37.96,13.48) 37.96,12.66 38.28,12.34 v1(39.42,12.34) 40.31,12.34 40.63,12.66 v1(40.63,13.36) v1(41.52,13.36) v1(42.41,13.36) v1(43.3,13.36) v1(44.25,13.36) v1(45.39,13.36) 46.15,13.36 v1(46.41,13.61) v1(46.41,14.5) v1(46.41,15.52) ; v1(46.41,15.52) 46.28,15.64 C7.1 ; 3.84,25.68 5.7,25.68
  Bottom Layer w0.254: 3.84,25.68 7.65,25.68 USB1.7 3.84,34.32
  vias: v1(3.48,15.58) v1(3.48,14.69) v1(4.37,15.58) v1(4.37,14.69) v1(5.13,15.58) v1(5.13,14.69) v1(6.02,15.58) v1(6.02,14.69) v1(8.42,7.06) v1(8.42,6.17) v1(8.42,5.41) v1(8.42,4.52) v1(10.96,7.57) v1(10.96,6.68) v1(10.96,5.92) v1(10.96,5.03) v1(13.55,7.59) v1(13.55,6.7) v1(13.55,5.94) v1(13.55,5.05) v1(15.92,8.08) v1(15.92,7.19) v1(15.92,6.43) v1(15.92,5.54) v1(18.63,7.99) v1(18.63,7.1) v1(18.63,6.34) v1(18.63,5.45) v1(21.56,7.92) v1(21.56,7.04) v1(21.56,6.27) v1(21.56,5.39) v1(23.92,7.89) v1(24.63,46.76) v1(24.63,45.87) v1(24.63,45.11) v1(24.63,44.22) v1(24.81,7.89) v1(25.52,46.76) v1(25.52,45.87) v1(25.52,45.11) v1(25.52,44.22) v1(27.87,6.89) v1(27.87,6.01) v1(31.13,7.63) v1(31.13,6.74) v1(48.06,11.83) v1(48.06,10.94) v1(48.06,10.12) v1(48.06,9.23) v1(48.69,43.72) v1(48.69,42.83) v1(48.95,11.83) v1(48.95,10.94) v1(48.95,10.12) v1(48.95,9.23) v1(49.58,43.72) v1(49.58,42.83) v1(49.71,11.83) v1(49.71,10.94) v1(49.71,10.12) v1(49.71,9.23) v1(49.84,14.18) v1(49.84,13.29) v1(50.34,43.72) v1(50.34,42.83) v1(50.6,11.83) v1(50.6,10.94) v1(50.6,10.12) v1(50.6,9.23) v1(50.69,45.52) v1(50.73,14.18) v1(50.73,13.29) v1(51.23,43.72) v1(51.23,42.83) v1(51.49,14.18) v1(51.49,13.29) v1(51.57,45.52) v1(52.38,14.18) v1(52.38,13.29) v1(59.5,50.56) v1(60.39,50.56) v1(61.05,49.8) v1(61.05,48.91)
P0.0: length 134.6
  Top Layer w0.254: R10.2 4.05,42.71 H1.1 4.05,51.41 4.3,51.66 56.33,51.66 61.48,46.51 61.48,39.74 61.88,39.33 82.66,39.33 ; 20.39,23.41 v1(18.5,23.41)
  Bottom Layer w0.254: H1.1 3.39,44.55 3.39,37.62 4.28,36.73 12.41,36.73 13.55,35.59 13.55,24.28 14.42,23.41 v1(18.5,23.41)
P0.1: length 126.8
  Top Layer w0.254: 82.02,38.8 61.72,38.8 61.12,39.4 61.12,46.37 56.18,51.31 8.03,51.31 6.59,49.86 H1.2 6.82,44.98 6.82,42.53 R11.2 ; 82.13,38.87 82.13,38.77 ; 19.79,24.16 v1(17.9,24.16)
  Bottom Layer w0.254: v1(17.9,24.16) 14.69,24.16 14.31,24.54 14.31,35.97 12.91,37.37 6.95,37.37 6.06,38.25 6.06,44.68 H1.2
P0.2: length 121.6
  Top Layer w0.254: R12.2 9.61,42.37 9.61,44.72 H1.3 9.13,50.24 9.84,50.95 56.03,50.95 60.76,46.22 60.76,39.26 61.71,38.31 82.77,38.31 ; 20.42,25.05 v1(18.54,25.05)
  Bottom Layer w0.254: H1.3 9.1,45.19 9.1,38.51 9.49,38.13 13.8,38.13 15.2,36.73 15.2,25.81 15.96,25.05 v1(18.54,25.05)
P0.3: length 114.7
  Top Layer w0.254: 19.79,25.81 v1(17.9,25.81) ; 82.43,37.84 61.52,37.84 60.41,38.95 60.41,46.07 55.89,50.6 11.92,50.6 11.67,50.34 H1.4 12.66,44.21 12.66,42.46 R13.2
  Bottom Layer w0.254: H1.4 11.77,45.1 11.77,39.4 12.28,38.89 14.31,38.89 15.96,37.24 15.96,26.7 16.85,25.81 v1(17.9,25.81)
P0.4: length 109.6
  Top Layer w0.254: v1(22.19,29.62) 22.19,27.4 ; 82.91,37.27 61.59,37.27 60.05,38.81 60.05,45.93 55.74,50.24 15.86,50.24 14.21,48.59 H1.5 15.58,43.83 15.58,42.43 R6.2
  Bottom Layer w0.254: v1(22.19,29.62) 22.19,30.51 21.68,31.02 17.99,31.02 17.36,31.65 17.36,37.37 16.72,38 16.22,38 14.57,39.65 14.57,44.85 H1.5
P0.5: length 104.6
  Top Layer w0.254: R7.2 18.26,43.69 H1.6 16.94,45.41 16.94,48.41 18.42,49.89 55.59,49.89 59.7,45.78 59.7,38.66 61.59,36.77 82.13,36.77 ; 22.95,27.44 v1(22.95,29.33)
  Bottom Layer w0.254: H1.6 16.98,44.98 16.98,38.89 17.99,37.87 17.99,32.29 18.5,31.78 21.8,31.78 22.95,30.63 v1(22.95,29.33)
P0.6: length 100.3
  Top Layer w0.254: 82.56,36.27 61.58,36.27 59.34,38.51 59.34,45.63 55.44,49.53 21.11,49.53 19.61,48.03 19.61,45.53 H1.7 21.22,43.28 R8.2 ; 23.84,27.32 v1(23.84,29.2)
  Bottom Layer w0.254: H1.7 19.29,39.25 19.9,38.64 20.66,38.64 21.3,38 21.3,33.94 23.84,31.4 v1(23.84,29.2)
P0.7: length 97.5
  Top Layer w0.254: 24.6,27.32 v1(24.6,29.2) ; R9.2 24.17,42.86 H1.8 21.83,47.7 23.3,49.17 55.3,49.17 58.98,45.49 58.98,38.37 61.58,35.77 82.71,35.77
  Bottom Layer w0.254: H1.8 22.31,44.72 22.31,39.27 23.07,38.51 24.22,38.51 24.6,38.13 v1(24.6,29.2)
P1.0: length 126.8
  Top Layer w0.254: U5.75 82.85,20.72 61.61,20.72 60.63,19.74 60.63,7.41 53.8,0.58 8.14,0.58 6.72,2 6.72,8 H2.1 4.53,12.98 5.55,14 13.55,14 14.18,14.63 14.18,20.35 14.85,21.01 20.39,21.01
P1.1: length 122.2
  Top Layer w0.254: 20.39,20.21 15.45,20.21 14.82,19.59 14.82,14.38 13.8,13.36 7.45,13.36 6.95,12.85 6.95,10.31 H2.2 7.07,2.15 8.28,0.94 53.66,0.94 60.28,7.55 60.28,20.1 61.48,21.3 82.69,21.3
P1.2: length 115.4
  Top Layer w0.254: 82.76,21.84 61.52,21.84 59.92,20.25 59.92,7.7 53.51,1.29 11.74,1.29 9.61,3.42 9.61,10.19 9.74,10.31 9.74,12.35 9.99,12.6 14.06,12.6 15.58,14.12 15.58,19.08 15.92,19.41 20.39,19.41
P1.3: length 108.5
  Top Layer w0.254: 20.39,18.61 16.9,18.61 16.22,17.93 16.22,14 14.18,11.97 12.41,11.97 11.9,11.46 11.9,10.44 H2.4 12.15,4.05 14.28,1.93 53.64,1.93 59.57,7.85 59.57,20.39 61.5,22.33 82.6,22.33 82.67,22.27
P1.4: length 101.8
  Top Layer w0.254: 82.47,22.81 61.48,22.81 59.21,20.54 59.21,8 53.77,2.56 16.72,2.56 14.69,4.59 14.69,10.19 14.95,10.44 14.95,11.84 16.72,13.62 16.72,17.31 17.23,17.81 20.39,17.81
P1.5: length 97.4
  Top Layer w0.254: 82.48,25.33 82.48,25.34 63.5,25.34 58.85,20.69 58.85,8.14 53.91,3.2 19.26,3.2 17.23,5.23 H2.6 17.23,12.73 18.38,13.87 21.55,13.87 22.13,14.45 22.13,16.08
P1.6: length 92.8
  Top Layer w0.254: 22.93,16.08 22.93,14.36 21.68,13.11 20.15,13.11 19.52,12.47 19.52,10.44 H2.7 19.77,5.64 19.74,5.61 21.52,3.83 54.04,3.83 58.5,8.29 58.5,20.84 63.43,25.77 82.43,25.77
P1.7: length 86.4
  Top Layer w0.254: 63.39,26.27 81.7,26.27 ; 23.73,16.08 23.73,14.01 22.44,12.73 22.44,10.31 H2.8 ; 82.83,26.31 82.8,26.28 81.74,26.28 ; 63.37,26.21 58.14,20.98 58.14,8.44 54.15,4.45 25.99,4.45 22.55,7.88 22.55,9.78
P2.0: length 78.1
  Top Layer w0.254: H3.1 47.28,44.53 55.33,44.53 55.58,44.28 55.58,37.43 61.19,31.82 83.42,31.82 83.45,31.85 ; 31.9,22.63 v1(33.63,22.63)
  Bottom Layer w0.254: H3.1 46.57,35.11 41.2,29.74 38.28,29.74 35.61,27.07 35.61,24.15 34.1,22.63 v1(33.63,22.63)
P2.1: length 80
  Top Layer w0.254: 32.03,23.4 v1(33.75,23.4) ; 83.41,32.27 83.38,32.3 61.21,32.3 55.94,37.57 55.94,44.79 54.04,46.68 45.47,46.68 H3.2
  Bottom Layer w0.254: v1(33.75,23.4) 33.88,23.52 34.24,23.52 35.11,24.39 35.11,27.33 38.03,30.25 41.07,30.25 44,33.17 44,33.28 44.03,33.31 H3.2
P2.2: length 80.1
  Top Layer w0.254: H3.3 43.29,47.04 54.19,47.04 56.46,44.77 56.46,37.88 61.54,32.8 83.31,32.8 83.33,32.77 ; v1(33.74,24.16) 32.16,24.16 32.03,24.28
  Bottom Layer w0.254: v1(33.74,24.16) 34.47,24.89 34.47,27.45 37.9,30.88 40.47,30.88 41.49,31.9 H3.3
P2.3: length 79.2
  Top Layer w0.254: 33.62,25.05 v1(33.58,25.01) U4.21 ; 83.14,33.32 61.57,33.27 56.81,38.02 56.81,44.92 54.34,47.4 41.11,47.4 H3.4
  Bottom Layer w0.254: H3.4 38.82,45.11 38.82,32.82 33.58,27.58 v1(33.58,25.01)
P2.4: length 80.4
  Top Layer w0.254: 33.23,29.71 33.23,26.06 32.99,25.81 U4.22 ; 33.23,29.71 LED2.1 ; 33.23,29.71 33.23,32.03 34.37,33.17 v1(36.25,33.17) ; H3.5 38.92,47.75 54.6,47.75 57.17,45.18 57.17,38.17 61.6,33.74 82.75,33.81
  Bottom Layer w0.254: H3.5 36.25,45.08 v1(36.25,33.17)
P2.5: length 80.2
  Top Layer w0.254: 30.19,27.44 v1(30.19,29.33) ; 33.98,45.08 37,48.11 54.81,48.11 57.92,45 57.92,37.92 61.53,34.31 82.59,34.31
  Bottom Layer w0.254: v1(30.19,29.33) 30.19,36.73 30.95,37.49 32.98,37.49 33.87,38.38 H3.6
P2.6: length 81.4
  Top Layer w0.254: H3.7 34.55,48.46 55,48.46 58.27,45.19 58.27,38.07 61.47,34.87 82.68,34.87 82.78,34.78 ; 29.42,27.32 v1(29.42,29.2)
  Bottom Layer w0.254: v1(29.42,29.2) 29.42,37.75 30.95,39.27 31.08,39.27 31.08,44.99 H3.7
P2.7: length 84.5
  Top Layer w0.254: H3.8 28.79,46.92 30.69,48.82 55.15,48.82 58.63,45.34 58.63,38.22 61.58,35.27 83.02,35.27 ; 28.54,27.32 v1(28.54,29.2)
  Bottom Layer w0.254: H3.8 28.54,44.99 v1(28.54,29.2)
P3.0: length 84.2
  Top Layer w0.254: 25.33,16.08 25.33,12.64 26.25,11.71 H4.1 26.25,5.5 26.72,5.04 54.24,5.04 57.79,8.59 57.79,21.94 62.66,26.82 82.47,26.79
P3.1: length 80.8
  Top Layer w0.254: 57.42,22.21 62.55,27.33 82.59,27.33 ; 26.93,16.08 26.93,12.69 27.9,11.71 28.54,11.71 28.79,11.46 H4.2 ; 28.76,9.56 28.76,7.5 30.87,5.39 54.09,5.39 57.43,8.73 57.43,22.21
P3.2: length 79.5
  Top Layer w0.254: 27.73,16.08 27.73,12.65 28.15,12.22 30.82,12.22 31.2,11.84 31.2,10.31 H4.3 ; 31.28,10.09 31.28,8.94 34.36,5.86 54.05,5.86 57.06,8.87 57.06,22.42 62.42,27.79 82.33,27.79 82.38,27.83
P3.3: length 79
  Top Layer w0.254: v1(34.44,7.86) 36.07,6.22 37.04,6.22 37.05,6.21 53.91,6.21 56.71,9.01 56.71,23.12 62.05,28.47 ; H4.4 33.74,10.31 33.74,12.47 32.99,13.23 29.52,13.23 28.53,14.22 28.53,16.08 ; 62.04,28.31 82.62,28.31 82.66,28.27
  Bottom Layer w0.254: v1(34.44,7.86) 34.44,9.25 33.69,10
P3.4: length 77.1
  Top Layer w0.254: 29.33,16.08 29.33,14.22 29.68,13.86 33.09,13.86 36.03,10.93 36.03,10.57 H4.5 ; 82.12,28.82 61.91,28.82 56.35,23.27 56.35,9.16 53.76,6.57 37.27,6.57 36.63,7.21 36.63,7.64 v1(36.5,7.77)
  Bottom Layer w0.254: v1(36.5,7.77) 36.5,10.09 H4.5
P3.5: length 75.3
  Top Layer w0.254: v1(39.04,8.02) 39.04,7.56 39.68,6.92 53.34,6.92 56,9.58 56,23.42 61.89,29.31 82.05,29.31 ; H4.6 37.43,11.71 35.99,11.71 33.32,14.38 30.57,14.38 30.13,14.83 30.13,16.08
  Bottom Layer w0.254: H4.6 38.95,8.12 v1(39.04,8.02)
P3.6: length 75.5
  Top Layer w0.254: H4.7 39.97,11.71 37.96,11.71 37.59,12.09 36.25,12.09 34.34,13.99 34.34,14.12 33.07,15.39 33.07,17.42 32.68,17.81 U4.12 ; 82.76,29.81 61.63,29.81 55.64,23.82 55.64,9.73 53.19,7.28 42.07,7.28 v1(41.46,7.9)
  Bottom Layer w0.254: H4.7 41.49,7.93 v1(41.46,7.9)
P3.7: length 81.4
  Top Layer w0.254: U4.13 33.15,18.61 33.96,17.8 v1(33.96,16.66) ; v1(32.44,12.59) 32.66,12.37 32.66,9.19 33.2,8.66 42.5,8.66 H4.8 46.58,7.64 53.04,7.64 55.28,9.88 55.28,24.07 61.56,30.34 82.7,30.34
  Bottom Layer w0.254: v1(33.96,16.66) 33.96,14.12 v1(32.44,12.59)
P4.0: length 39
  Top Layer w0.254: v1(37.14,39.01) 49.2,39.01 50.09,38.12 50.09,35.2 H5.1 ; U4.17 v1(30.03,21.81)
  Bottom Layer w0.254: v1(37.14,39.01) 37.14,32.03 31.55,26.44 30.53,26.44 30.03,25.93 v1(30.03,21.81)
P4.1: length 30.9
  Top Layer w0.254: 26.13,27.26 26.13,30.03 26.6,30.5 31.93,30.5 32.69,31.26 32.69,32.79 33.58,33.68 35.11,33.68 35.36,33.93 40.69,33.93 43.23,31.39 v1(46.41,31.39)
  Bottom Layer w0.254: v1(46.41,31.39) 49.08,31.39 H5.2
P4.2: length 57.8
  Top Layer w0.254: 20.08,21.74 v1(18.19,21.74)
  Bottom Layer w0.254: v1(18.19,21.74) 27.1,21.74 27.61,21.23 27.61,13.99 29.88,11.72 45.54,11.72 47.55,13.74 47.55,27.33 50.22,29.99
P4.3: length 42
  Top Layer w0.254: 26.13,16.08 v1(26.13,13.87)
  Bottom Layer w0.254: v1(26.13,13.87) 28.63,11.37 46.07,11.37 48.19,13.48 48.19,27.2 48.44,27.45 H5.4
P4.4: length 51.8
  Top Layer w0.254: 27.77,27.32 v1(27.77,29.2) ; v1(27.74,39.77) 50.85,39.77 52.12,38.5 52.12,26.82 50.22,24.91
  Bottom Layer w0.254: v1(27.77,29.2) 27.74,29.24 v1(27.74,39.77)
P4.5: length 58
  Top Layer w0.254: v1(27.01,40.92) 51.11,40.92 52.76,39.26 52.76,24.91 H5.6 ; 27.01,27.32 v1(27.01,29.2)
  Bottom Layer w0.254: v1(27.01,29.2) v1(27.01,40.92)
P4.6: length 65.1
  Top Layer w0.254: 50.22,19.83 53.39,23.01 53.39,40.28 51.74,41.93 v1(25.33,41.93) ; 25.36,27.32 v1(25.36,29.2)
  Bottom Layer w0.254: v1(25.33,41.93) 25.33,41.08 25.36,41.04 v1(25.36,29.2)
RST: length 29.9
  Top Layer w0.254: v1(24.47,13.87) 24.47,16.03 24.53,16.08 ; 10.63,20.2 R3.2 ; 10.63,20.2 v1(10.63,17.17) ; 10.63,20.2 9.76,19.33 SW1.2 8.09,19.71 8.09,22.25 7.71,22.63 6.83,22.63 C8.1
  Bottom Layer w0.254: v1(24.47,13.87) 11.64,13.87 10.63,14.89 v1(10.63,17.17)
XTAL1: length 16
  Top Layer w0.254: U4.15 34.63,20.21 35.14,20.73 38.95,20.73 39.33,21.11 X1.2 39.69,24.41 43.71,24.41
XTAL2: length 15.9
  Top Layer w0.254: 43.93,15.64 39.36,15.64 X1.1 39.33,18.82 38.19,19.96 37.04,19.96 36.49,19.41 U4.14
$1N502: length 2.6
  Top Layer w0.254: LED1.2 44.19,35.46 45.94,35.46 R1.2
$1N504: length 2.4
  Top Layer w0.254: LED2.2 35.35,29.79 R2.2
$1N2677: length 2.6
  Top Layer w0.254: R4.1 9.24,29.5 USB1.B5
$1N2681: length 2.3
  Top Layer w0.254: USB1.B9 9.96,31.5 R5.1

## Copper pours and planes (outline as drawn; the poured copper is in the pictures)
GND on Top Layer: -16.18,53.6 95.12,53.6 95.12,-2.59 -16.18,-2.59
GND on Bottom Layer: -28.35,67.62 108.47,67.62 108.47,-12.7 -28.35,-12.7

## Text on the board
Top Silkscreen Layer: 0 | 1 | 2 | 3 | 4 | 5 | 6 | 7 | 3V3
